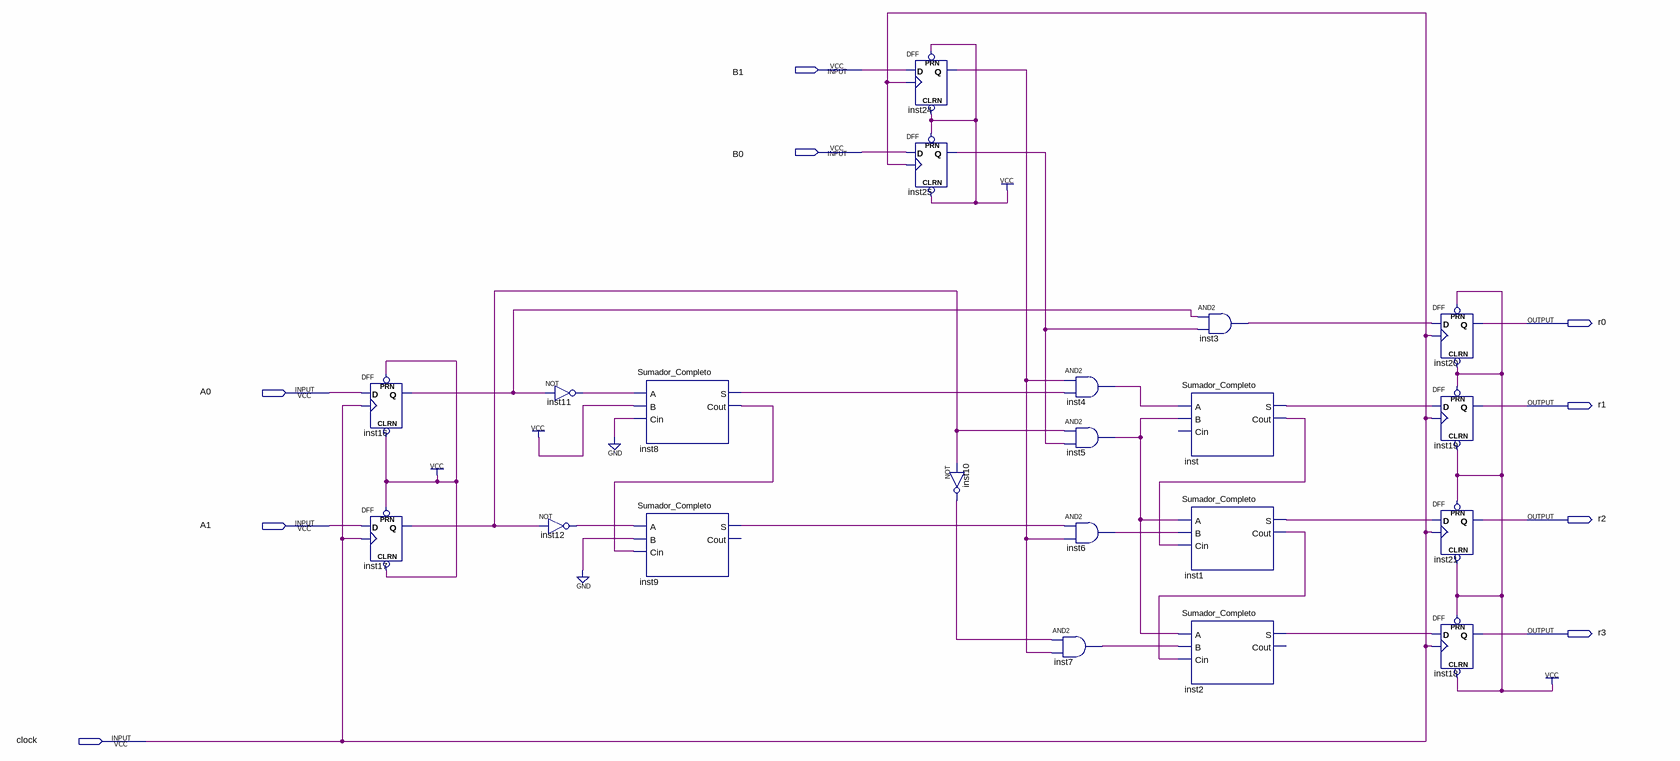
[diagram p0: schematic sheet]
// Quartus schematic esquematico.bdf as structural Verilog: 21 symbols, 9 pins
module esquematico (
  input  B1,
  input  B0,
  input  A0,
  input  A1,
  input  clock,
  output r0,
  output r1,
  output r2,
  output r3
);

  wire inst1_cout, inst1_s, inst2_s, inst3_out, inst4_out, inst5_out, inst6_out, inst7_out, inst8_cout,
       inst8_s, inst9_s, inst10_out, inst11_out, inst12_out, inst16_q, inst17_q, inst24_q, inst25_q,
       inst_cout, inst_s;

  DFF inst16 (.CLRN(1'b1), .CLK(clock), .D(A0), .PRN(1'b1), .Q(inst16_q));
  DFF inst17 (.CLRN(1'b1), .CLK(clock), .D(A1), .PRN(1'b1), .Q(inst17_q));
  not inst11 (inst11_out, inst16_q);
  not inst12 (inst12_out, inst17_q);
  Sumador_Completo inst8 (.A(inst11_out), .B(1'b1), .Cin(1'b0), .S(inst8_s), .Cout(inst8_cout));
  Sumador_Completo inst9 (.A(inst12_out), .B(1'b0), .Cin(inst8_cout), .S(inst9_s));  // open: Cout
  DFF inst24 (.CLRN(1'b1), .CLK(clock), .D(B1), .PRN(1'b1), .Q(inst24_q));
  DFF inst25 (.CLRN(1'b1), .CLK(clock), .D(B0), .PRN(1'b1), .Q(inst25_q));
  not inst10 (inst10_out, inst17_q);
  and inst7 (inst7_out, inst10_out, inst24_q);
  and inst4 (inst4_out, inst24_q, inst8_s);
  and inst5 (inst5_out, inst17_q, inst25_q);
  and inst6 (inst6_out, inst9_s, inst24_q);
  and inst3 (inst3_out, inst16_q, inst25_q);
  Sumador_Completo inst (.A(inst4_out), .B(inst5_out), .S(inst_s), .Cout(inst_cout));  // open: Cin
  Sumador_Completo inst1 (.A(inst5_out), .B(inst6_out), .Cin(inst_cout), .S(inst1_s), .Cout(inst1_cout));
  Sumador_Completo inst2 (.A(inst5_out), .B(inst7_out), .Cin(inst1_cout), .S(inst2_s));  // open: Cout
  DFF inst20 (.CLRN(1'b1), .CLK(clock), .D(inst3_out), .PRN(1'b1), .Q(r0));
  DFF inst19 (.CLRN(1'b1), .CLK(clock), .D(inst_s), .PRN(1'b1), .Q(r1));
  DFF inst21 (.CLRN(1'b1), .CLK(clock), .D(inst1_s), .PRN(1'b1), .Q(r2));
  DFF inst18 (.CLRN(1'b1), .CLK(clock), .D(inst2_s), .PRN(1'b1), .Q(r3));
endmodule
